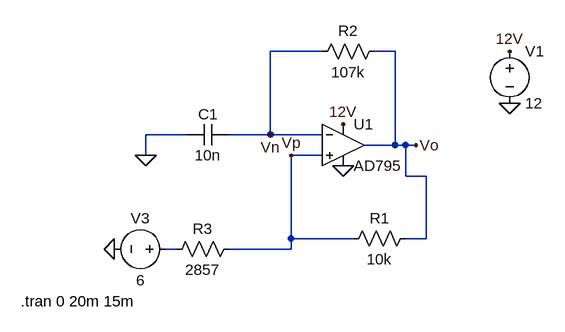
[diagram p0: schematic lab9.q.asc]
lab9.q.asc, the LTspice schematic file:
Version 4
SHEET 1 880 680
WIRE 176 64 96 64
WIRE 288 64 256 64
WIRE -32 192 -96 192
WIRE 96 192 96 64
WIRE 96 192 32 192
WIRE 176 192 96 192
WIRE 288 208 288 64
WIRE 288 208 240 208
WIRE 304 208 288 208
WIRE 320 208 304 208
WIRE -96 224 -96 192
WIRE 176 224 128 224
WIRE 304 256 304 208
WIRE 336 256 304 256
WIRE 128 352 128 224
WIRE 224 352 128 352
WIRE 336 352 336 256
WIRE 336 352 304 352
WIRE -48 368 -64 368
WIRE 128 368 128 352
WIRE 128 368 32 368
FLAG 464 144 0
FLAG 464 64 12V
FLAG 208 176 12V
FLAG -96 224 0
FLAG 320 208 Vo
FLAG 96 192 Vn
FLAG 128 224 Vp
FLAG -144 368 0
FLAG 208 240 0
SYMBOL Opamps\\AD795 208 144 R0
SYMATTR InstName U1
SYMBOL voltage 464 48 R0
SYMATTR InstName V1
SYMATTR Value 12
SYMBOL res 320 336 R90
WINDOW 0 0 56 VBottom 2
WINDOW 3 32 56 VTop 2
SYMATTR InstName R1
SYMATTR Value 10k
SYMBOL res 272 48 R90
WINDOW 0 0 56 VBottom 2
WINDOW 3 32 56 VTop 2
SYMATTR InstName R2
SYMATTR Value 107k
SYMBOL res 48 352 R90
WINDOW 0 0 56 VBottom 2
WINDOW 3 32 56 VTop 2
SYMATTR InstName R3
SYMATTR Value 2857
SYMBOL cap 32 176 R90
WINDOW 0 0 32 VBottom 2
WINDOW 3 32 32 VTop 2
SYMATTR InstName C1
SYMATTR Value 10n
SYMBOL voltage -48 368 R90
WINDOW 0 -32 56 VBottom 2
WINDOW 3 32 56 VTop 2
SYMATTR InstName V3
SYMATTR Value 6
TEXT -288 448 Left 2 !.tran 0 20m 15m

The netlist it stands for:
* lab9.q.asc
XU1 Vp Vn 12V 0 Vo AD795  ; pins In+ In- V+ V- OUT
V1 12V 0 12
R1 Vo Vp 10k
R2 Vo Vn 107k
R3 Vp N001 2857
C1 Vn 0 10n
V3 N001 0 6
.tran 0 20m 15m
.lib ADI1.lib
.backanno
.end